# EAGLE design H4_MainController_Rev_1 (EAGLE 7.6.0)
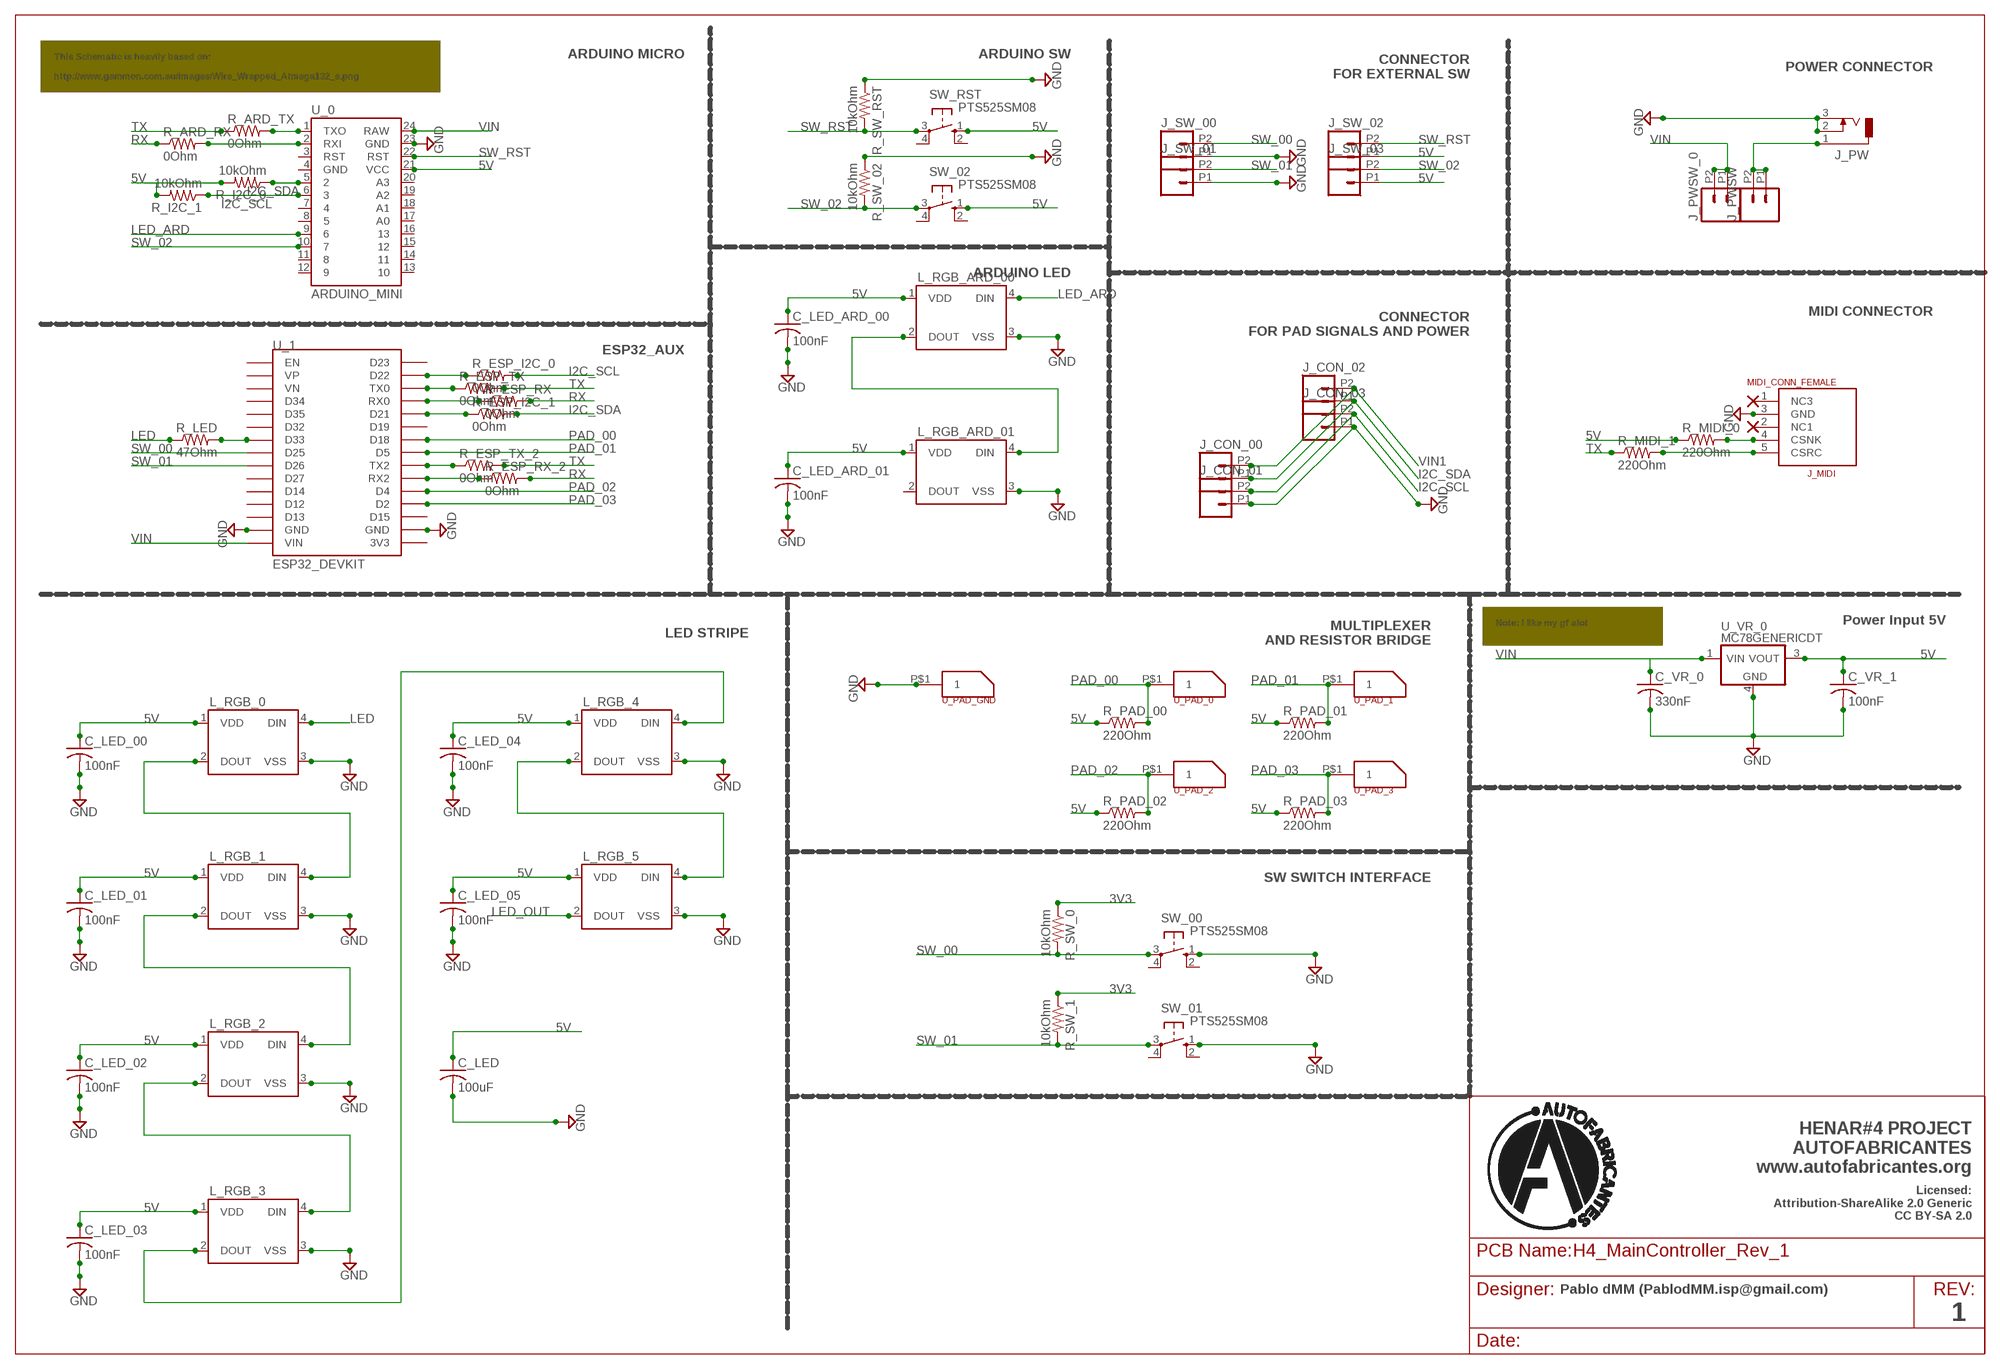
[diagram p0: schematic, sheet 1]

## Parts
C_LED  100uF  C-USC1210  [C1210]
C_LED_00  100nF  C-USC0805K  [C0805K]
C_LED_01  100nF  C-USC0805K  [C0805K]
C_LED_02  100nF  C-USC0805K  [C0805K]
C_LED_03  100nF  C-USC0805K  [C0805K]
C_LED_04  100nF  C-USC0805K  [C0805K]
C_LED_05  100nF  C-USC0805K  [C0805K]
C_LED_ARD_00  100nF  C-USC0805K  [C0805K]
C_LED_ARD_01  100nF  C-USC0805K  [C0805K]
C_VR_0  330nF  C-USC0805  [C0805]
C_VR_1  100nF  C-USC0805  [C0805]
J_CON_00  M022.54MM_SCREWTERM  [1X02_2.54_SCREWTERM]
J_CON_01  M022.54MM_SCREWTERM  [1X02_2.54_SCREWTERM]
J_CON_02  M022.54MM_SCREWTERM  [1X02_2.54_SCREWTERM]
J_CON_03  M022.54MM_SCREWTERM  [1X02_2.54_SCREWTERM]
J_MIDI  MIDI_CONN_FEMALE  [DIN_5_FEMALE]
J_PW  DCJ0303  [DCJ0303]
J_PWSW  M022.54MM_SCREWTERM  [1X02_2.54_SCREWTERM]
J_PWSW_0  M022.54MM_SCREWTERM  [1X02_2.54_SCREWTERM]
J_SW_00  M022.54MM_SCREWTERM  [1X02_2.54_SCREWTERM]
J_SW_01  M022.54MM_SCREWTERM  [1X02_2.54_SCREWTERM]
J_SW_02  M022.54MM_SCREWTERM  [1X02_2.54_SCREWTERM]
J_SW_03  M022.54MM_SCREWTERM  [1X02_2.54_SCREWTERM]
L_RGB_0  WS2812B  [WS2812B]
L_RGB_1  WS2812B  [WS2812B]
L_RGB_2  WS2812B  [WS2812B]
L_RGB_3  WS2812B  [WS2812B]
L_RGB_4  WS2812B  [WS2812B]
L_RGB_5  WS2812B  [WS2812B]
L_RGB_ARD_00  WS2812B  [WS2812B]
L_RGB_ARD_01  WS2812B  [WS2812B]
R_ARD_RX  0Ohm  R-US_M0805  [M0805]
R_ARD_TX  0Ohm  R-US_M0805  [M0805]
R_ESP_I2C_0  0Ohm  R-US_M0805  [M0805]
R_ESP_I2C_1  0Ohm  R-US_M0805  [M0805]
R_ESP_RX  0Ohm  R-US_M0805  [M0805]
R_ESP_RX_2  0Ohm  R-US_M0805  [M0805]
R_ESP_TX  0Ohm  R-US_M0805  [M0805]
R_ESP_TX_2  0Ohm  R-US_M0805  [M0805]
R_I2C_0  10kOhm  R-US_M0805  [M0805]
R_I2C_1  10kOhm  R-US_M0805  [M0805]
R_LED  47Ohm  R-US_M0805  [M0805]
R_MIDI_0  220Ohm  R-US_M0805  [M0805]
R_MIDI_1  220Ohm  R-US_M0805  [M0805]
R_PAD_00  220Ohm  R-US_M0805  [M0805]
R_PAD_01  220Ohm  R-US_M0805  [M0805]
R_PAD_02  220Ohm  R-US_M0805  [M0805]
R_PAD_03  220Ohm  R-US_M0805  [M0805]
R_SW_0  10kOhm  R-US_M0805  [M0805]
R_SW_1  10kOhm  R-US_M0805  [M0805]
R_SW_02  10kOhm  R-US_M0805  [M0805]
R_SW_RST  10kOhm  R-US_M0805  [M0805]
SW_00  PTS525SM08  [SM08]
SW_01  PTS525SM08  [SM08]
SW_02  PTS525SM08  [SM08]
SW_RST  PTS525SM08  [SM08]
U_0  ARDUINO_MINI  [ARDUINO_MINI]
U_1  ESP32_DEVKIT  [ESP32_DEVKIT]
U_PAD_0  PAD_CONNECTOR_MULTI  [PAD_CONNECTOR_MULTI]
U_PAD_1  PAD_CONNECTOR_MULTI  [PAD_CONNECTOR_MULTI]
U_PAD_2  PAD_CONNECTOR_MULTI  [PAD_CONNECTOR_MULTI]
U_PAD_3  PAD_CONNECTOR_MULTI  [PAD_CONNECTOR_MULTI]
U_PAD_GND  PAD_CONNECTOR_MULTI  [PAD_CONNECTOR_MULTI]
U_VR_0  MC78GENERICDT  [DPAK-3]

## Nets
3V3: R_SW_0.1 R_SW_1.1
5V [VCC]: C_LED.1 C_LED_00.1 C_LED_01.1 C_LED_02.1 C_LED_03.1 C_LED_04.1 C_LED_05.1 C_LED_ARD_00.1 C_LED_ARD_01.1 C_VR_1.1 J_SW_02.P1 J_SW_03.P1 L_RGB_0.1(VDD) L_RGB_1.1(VDD) L_RGB_2.1(VDD) L_RGB_3.1(VDD) L_RGB_4.1(VDD) L_RGB_5.1(VDD) L_RGB_ARD_00.1(VDD) L_RGB_ARD_01.1(VDD) R_I2C_0.2 R_I2C_1.2 R_MIDI_0.1 R_PAD_00.1 R_PAD_01.1 R_PAD_02.1 R_PAD_03.1 SW_02.1(S) SW_RST.1(S) U_0.21(VCC) U_VR_0.3(VOUT)
GND [GND]: C_LED.2 C_LED_00.2 C_LED_01.2 C_LED_02.2 C_LED_03.2 C_LED_04.2 C_LED_05.2 C_LED_ARD_00.2 C_LED_ARD_01.2 C_VR_0.2 C_VR_1.2 J_CON_01.P1 J_CON_03.P1 J_MIDI.3(GND) J_PW.2 J_PW.3 J_SW_00.P1 J_SW_01.P1 L_RGB_0.3(VSS) L_RGB_1.3(VSS) L_RGB_2.3(VSS) L_RGB_3.3(VSS) L_RGB_4.3(VSS) L_RGB_5.3(VSS) L_RGB_ARD_00.3(VSS) L_RGB_ARD_01.3(VSS) R_SW_02.1 R_SW_RST.1 SW_00.1(S) SW_01.1(S) U_0.23(GND) U_1.GND@1(GND) U_1.GND@2(GND) U_PAD_GND.P$1 U_VR_0.4(GND)
I2C_SCL: J_CON_01.P2 J_CON_03.P2 R_ESP_I2C_0.2 R_I2C_1.1 U_0.6
I2C_SDA: J_CON_00.P1 J_CON_02.P1 R_ESP_I2C_1.2 R_I2C_0.1 U_0.5
LED: L_RGB_0.4(DIN) R_LED.1
LED_ARD: L_RGB_ARD_00.4(DIN) U_0.9
LED_OUT: L_RGB_5.2(DOUT)
LEDE: L_RGB_3.2(DOUT) L_RGB_4.4(DIN)
N$1: R_ESP_TX.1 U_1.TX0
N$2: R_ESP_RX.1 U_1.RX0
N$3: L_RGB_2.2(DOUT) L_RGB_3.4(DIN)
N$4: J_MIDI.4(CSNK) R_MIDI_0.2
N$5: R_ARD_TX.2 U_0.1(TXO)
N$6: R_ARD_RX.2 U_0.2(RXI)
N$7: R_ESP_TX_2.1 U_1.TX2
N$8: R_LED.2 U_1.D33
N$9: L_RGB_1.2(DOUT) L_RGB_2.4(DIN)
N$10: L_RGB_0.2(DOUT) L_RGB_1.4(DIN)
N$11: R_ESP_RX_2.1 U_1.RX2
N$12: L_RGB_ARD_00.2(DOUT) L_RGB_ARD_01.4(DIN)
N$13: J_MIDI.5(CSRC) R_MIDI_1.2
N$14: L_RGB_4.2(DOUT) L_RGB_5.4(DIN)
N$15: R_ESP_I2C_0.1 U_1.D22
N$16: R_ESP_I2C_1.1 U_1.D21
N$17: J_PW.1 J_PWSW.P1 J_PWSW.P2
PAD_00: R_PAD_00.2 U_1.D18 U_PAD_0.P$1
PAD_01: R_PAD_01.2 U_1.D5 U_PAD_1.P$1
PAD_02: R_PAD_02.2 U_1.D4 U_PAD_2.P$1
PAD_03: R_PAD_03.2 U_1.D2 U_PAD_3.P$1
RX: R_ARD_RX.1 R_ESP_RX.2 R_ESP_RX_2.2
SW_00: J_SW_00.P2 R_SW_0.2 SW_00.3(P) U_1.D25
SW_01: J_SW_01.P2 R_SW_1.2 SW_01.3(P) U_1.D26
SW_02: J_SW_03.P2 R_SW_02.2 SW_02.3(P) U_0.10
SW_RST: J_SW_02.P2 R_SW_RST.2 SW_RST.3(P) U_0.22(RST)
TX: R_ARD_TX.1 R_ESP_TX.2 R_ESP_TX_2.2 R_MIDI_1.1
VIN [VCC]: C_VR_0.1 J_PWSW_0.P1 J_PWSW_0.P2 U_0.24(RAW) U_1.VIN U_VR_0.1(VIN)
VIN1: J_CON_00.P2 J_CON_02.P2
Unconnected: J_MIDI.1(NC3) J_MIDI.2(NC1) L_RGB_ARD_01.2(DOUT) SW_00.2(S) SW_00.4(P) SW_01.2(S) SW_01.4(P) SW_02.2(S) SW_02.4(P) SW_RST.2(S) SW_RST.4(P) U_0.3(RST) U_0.4(GND) U_0.7 U_0.8 U_0.11 U_0.12 U_0.13 U_0.14 U_0.15 U_0.16 U_0.17(A0) U_0.18(A1) U_0.19(A2) U_0.20(A3) U_1.3V3 U_1.D12 U_1.D13 U_1.D14 U_1.D15 U_1.D19 U_1.D23 U_1.D27 U_1.D32 U_1.D34 U_1.D35 U_1.EN U_1.VN U_1.VP

## Notes on the sheet
- This Schematic is heavily based on:
  
  http://www.gammon.com.au/images/Wire_Wrapped_Atmega132_e.png
- ARDUINO MICRO | ARDUINO SW
- CONNECTOR
  FOR EXTERNAL SW
- POWER CONNECTOR
- ARDUINO LED
- MIDI CONNECTOR
- CONNECTOR
  FOR PAD SIGNALS AND POWER
- ESP32_AUX
- Note: I like my gf alot | Power Input 5V
- LED STRIPE
- MULTIPLEXER
  AND RESISTOR BRIDGE
- SW SWITCH INTERFACE
- HENAR#4 PROJECT
  AUTOFABRICANTES
  www.autofabricantes.org
- Licensed:
  Attribution-ShareAlike 2.0 Generic
  CC BY-SA 2.0
- Pablo dMM (PablodMM.isp@gmail.com)
- 1

## Library data of the parts
C_LED C_LED_00 C_LED_01-C_LED_05 C_LED_ARD_00 C_LED_ARD_01 C_VR_0 C_VR_1 = adafruit:C-US: CAPACITOR, American symbol
J_CON_00 J_CON_01-J_CON_03 J_PWSW J_PWSW_0 J_SW_00 J_SW_01-J_SW_03 = SparkFun-Connectors:M02: Standard 2-pin 0.1" header. Use with - straight break away headers ( PRT-00116) - right angle break away headers (PRT-00553) - swiss pins (PRT-00743) - machine pins (PRT-00117) - female headers (PRT-00115) Molex polarized connector foot print use with: PRT-08233 with associated crimp pins and housings. 2.54_SCREWTERM for use with PRT-10571. 3.5mm Screw Terminal footprints for PRT-08084 5mm Screw Terminal footprints for use with PRT-08432
J_MIDI = SparkFun-Connectors:MIDI_CONN_FEMALE: MIDI connector, no strain relieve (DIN-5 female)
J_PW = con-jack:DCJ0303: DC POWER JACK Source: DCJ0303.pdf; OC_FARNELL: unknown; OC_NEWARK: unknown
L_RGB_0 L_RGB_1-L_RGB_5 L_RGB_ARD_00 L_RGB_ARD_01 = SparkFun-LED:WS2812B: WS2812B - Intelligent control LED integrated light source Technical Specifications: Power Supply Voltage (VDD): 3.5 to 5.3 V Input Voltage (VI): -0.5 to VDD+0.5 V Operating Junction Temperature (Topt): -25°C to +80°C Storage Temperature Range (Tstg): -55°C to +150°C; PROD_ID: DIO-12503
R_ARD_RX R_ARD_TX R_ESP_I2C_0 R_ESP_I2C_1 R_ESP_RX R_ESP_RX_2 R_ESP_TX R_ESP_TX_2 R_I2C_0 R_I2C_1 R_LED R_MIDI_0 R_MIDI_1 R_PAD_00 R_PAD_01-R_PAD_03 R_SW_0 R_SW_1 R_SW_02 R_SW_RST = adafruit:R-US_: RESISTOR, American symbol
SW_00 SW_01 SW_02 SW_RST = pts525_20:PTS525*: PTS 525 Series Miniature Tact Switch for SMD Source: http://www.ck-components.com/14407/pts525_8sept14.pdf/; MF: C&K Components; MPN: PTS525SM08SMTR2LFS; OC_FARNELL: unknown; OC_NEWARK: unknown
U_0 = SparkFun-Boards:ARDUINO_MINI: Arduino Pro Mini footprint
U_1 = DOIT_ESP32_DEVKIT:ESP32_DEVKIT: ESP32 DEVKIT BOARD
U_PAD_0 U_PAD_1-U_PAD_3 U_PAD_GND = atfHenar_customLib:PAD_CONNECTOR_MULTI
U_VR_0 = _hhn_78xx_79xx_NCV78xx_d2pak_dpak:MC78*: 78xx SMD (D2PAK, DPAK) (MC)78xx..DT (DPAK-3; Rth,JA = 92 K/W) (MC)78xx..D2T (D2PAK-3; Rth,JA = 45 K/W @ 10x10mm copper area) Linear Voltage Regulators, Positive, 1 A (ON Semiconductor) Package dimenisions and soldering footprints acc. to ONSEMI specs. Source: http://onsemi.com Datasheet document#: MC7800/D Technologies: 78xxyD(2)Tz: xx = Output Voltage (V) y, z: additional suffixes see manufacturer's datasheet Author: Dipl.-Ing. FH Rainer Bayer HHN Hochschule Heilbronn, rainer.bayer@hs-heilbronn.de Ingenieurbüro ing-rb, mail@ing-rb.de

## Net classes
1 GND: width 0.508 mm, clearance 0.305 mm
2 VCC: width 0.508 mm, clearance 0.305 mm to class 1

## Board
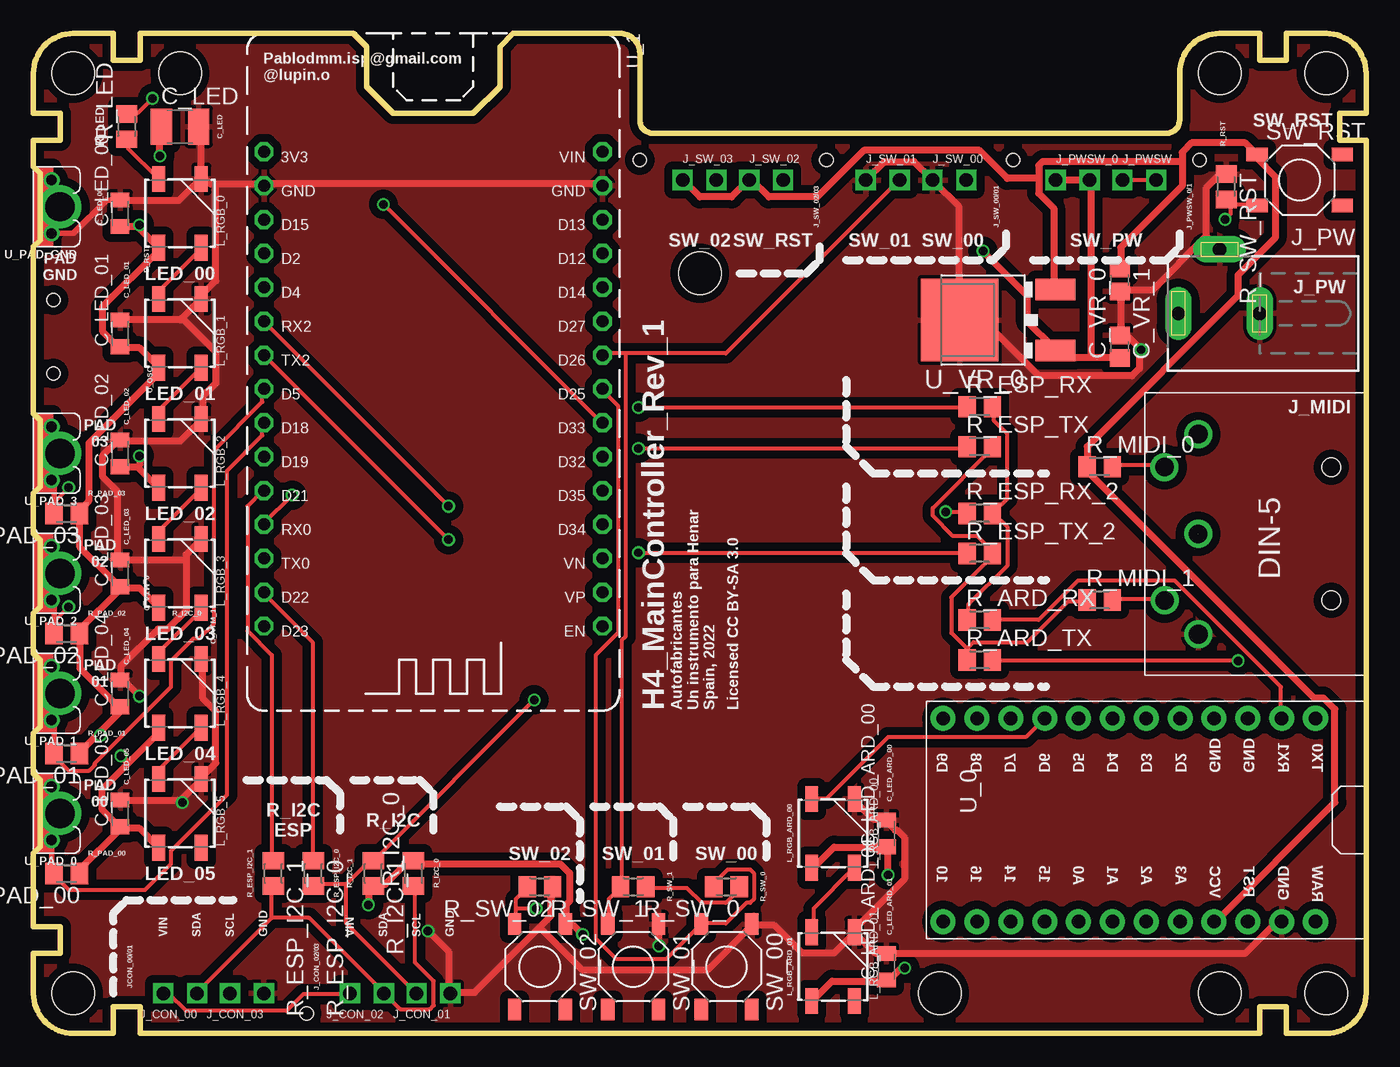
[diagram p1: board, top side]
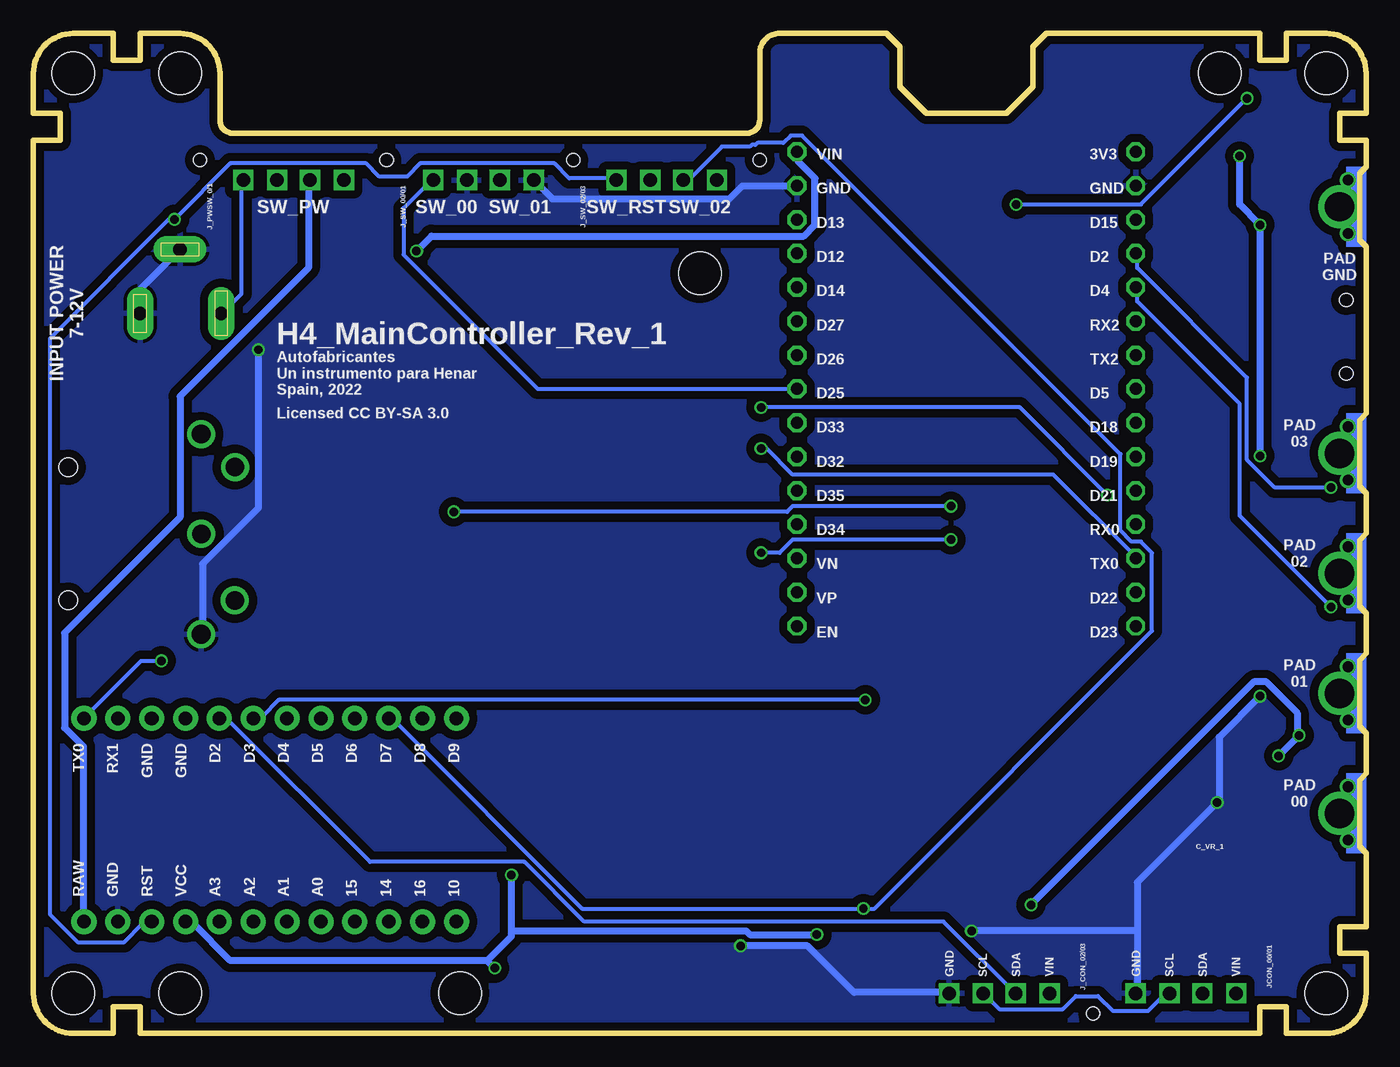
[diagram p2: board, bottom side, seen from below]

Size 100 x 75 mm. Coordinates in mm from the lower left corner, seen from the top.
Outline: 97,0 94,0 94,2 92,2 92,0 8,0 8,2 6,2 6,0 3,0 arc-90 0,3 0,6 2,6 2,8 0,8 0,13.5 0.5,14 0.5,19 0,19.5 0,22.5 0.5,23 0.5,28 0,28.5 0,31.5 0.5,32 0.5,37 0,37.5 0,40.5 0.5,41 0.5,46 0,46.5 0,59 0.5,59.5 0.5,64.5 0,65 0,67 2,67 2,69 0,69 0,72 arc-90 3,75 6,75 6,73 8,73 8,75 24,75 25,74 25,71 27,69 33,69 35,71 35,74 36,75 44,75 arc-90 45.5,73.5 45.5,68.5 arc90 46.5,67.5 85,67.5 arc90 86,68.5 86,72 arc-90 89,75 92,75 92,73 94,73 94,75 97,75 arc-90 100,72 100,69 98,69 98,67 100,67 100,3 arc-90 97,0
Copper layers (1*16): Top 0.035mm / dielectric 1.5mm / Bottom 0.035mm
Design rules "default *": minimum track width 12mil, minimum drill 25mil, track to track 10mil, track to pad 10mil, pad to pad 10mil, via to via 10mil, smd to smd 8mil, copper to edge 20mil, drill to drill 8mil, minimum pad ring 5mil, minimum via ring 5mil, stop-mask expansion 4mil, vias tented up to drill 0mil, thermal gap 10mil
Holes 1 mm at 20.5,1.5 20.5,1.5 1.5,55 1.5,49.5 87.5,65.5 73.5,65.5 59.5,65.5 45.5,65.5 73.5,65.5 59.5,65.5
Holes 3.2 mm at 97,3 3,3 3,72 97,72 68,3 89,3 89,72 11,72 50,57

### Footprints (pad centres in the part's own frame; a part is rotated, then mirrored left to right if it is on the bottom)
C1210 = smd 1.6 x 2.7: 1 -1.4,0; 2 1.4,0
C0805K = smd 1.1 x 1.4: 1 -1,0; 2 1,0
C0805 = smd 1.3 x 1.5: 1 -0.85,0; 2 0.85,0
1X02_2.54_SCREWTERM = drill 1.016 square: P1 2.54,0; P2 0,0
DIN_5_FEMALE = drill 1.4: 1 7.94,3.6; 2 0.46,3.61; 3 -7.07,3.6; 4 5.47,6.13; 5 -4.53,6.12 | hole 1.4: -4.52,-6.38; 5.47,-6.38
DCJ0303 = drill 1 pad 2 long: 1 0,3.1; 2 4.8,0; 3 0,-3
WS2812B = smd 1.93 x 0.965: 1 -2.577,1.6; 2 -2.577,-1.6; 3 2.577,-1.6; 4 2.577,1.6
M0805 = smd 1.3 x 1.6: 1 -0.95,0; 2 0.95,0
SM08 = smd 1.6 x 1: 1 -3.2,1.9; 2 3.2,1.9; 3 -3.2,-1.9; 4 3.2,-1.9
ARDUINO_MINI = drill 1.016 pad 1.88: 1 -7.62,12.7; 2 -7.62,10.16; 3 -7.62,7.62; 4 -7.62,5.08; 5 -7.62,2.54; 6 -7.62,0; 7 -7.62,-2.54; 8 -7.62,-5.08; 9 -7.62,-7.62; 10 -7.62,-10.16; 11 -7.62,-12.7; 12 -7.62,-15.24; 13 7.62,-15.24; 14 7.62,-12.7; 15 7.62,-10.16; 16 7.62,-7.62; 17 7.62,-5.08; 18 7.62,-2.54; 19 7.62,0; 20 7.62,2.54; 21 7.62,5.08; 22 7.62,7.62; 23 7.62,10.16; 24 7.62,12.7
ESP32_DEVKIT = drill 0.9 pad 1.422 octagon: 3V3 12.7,8.89; D2 12.7,16.51; D4 12.7,19.05; D5 12.7,26.67; D12 -12.7,16.51; D13 -12.7,13.97; D14 -12.7,19.05; D15 12.7,13.97; D18 12.7,29.21; D19 12.7,31.75; D21 12.7,34.29; D22 12.7,41.91; D23 12.7,44.45; D25 -12.7,26.67; D26 -12.7,24.13; D27 -12.7,21.59; D32 -12.7,31.75; D33 -12.7,29.21; D34 -12.7,36.83; D35 -12.7,34.29; EN -12.7,44.45; GND@1 -12.7,11.43; GND@2 12.7,11.43; RX0 12.7,36.83; RX2 12.7,21.59; TX0 12.7,39.37; TX2 12.7,24.13; VIN -12.7,8.89; VN -12.7,39.37; VP -12.7,41.91
PAD_CONNECTOR_MULTI = drill 0.8: P$1 0.63,2; P$2 0.63,-2 | drill 2.2: P$3 0,0
DPAK-3 = smd 1.6 x 3: 1 -2.286,-7.18; 3 2.286,-7.18 | smd 6.2 x 5.8: 4 0,0

### Placement (x,y rotation side)
C_LED  11,68 0 top
C_LED_00  6.5,61.5 90 top
C_LED_01  6.5,52.5 90 top
C_LED_02  6.5,43.5 90 top
C_LED_03  6.5,34.5 90 top
C_LED_04  6.5,25.5 90 top
C_LED_05  6.5,16.5 90 top
C_LED_ARD_00  64,15 90 top
C_LED_ARD_01  64,5 90 top
C_VR_0  81.5,51.5 90 top
C_VR_1  81.5,56.5 270 top
J_CON_00  9.75,3 0 top
J_CON_01  28.75,3 0 top
J_CON_02  23.75,3 0 top
J_CON_03  14.75,3 0 top
J_MIDI  91,37 90 top
J_PW  89,54 90 top
J_PWSW  84.25,64 180 top
J_PWSW_0  79.25,64 180 top
J_SW_00  70,64 180 top
J_SW_01  65,64 180 top
J_SW_02  56.25,64 180 top
J_SW_03  51.25,64 180 top
L_RGB_0  11,61.5 90 top
L_RGB_1  11,52.5 90 top
L_RGB_2  11,43.5 90 top
L_RGB_3  11,34.5 90 top
L_RGB_4  11,25.5 90 top
L_RGB_5  11,16.5 90 top
L_RGB_ARD_00  60,15 90 top
L_RGB_ARD_01  60,5 90 top
R_ARD_RX  71,31 0 top
R_ARD_TX  71,28 0 top
R_ESP_I2C_0  21,12 270 top
R_ESP_I2C_1  18,12 270 top
R_ESP_RX  71,47 0 top
R_ESP_RX_2  71,39 0 top
R_ESP_TX  71,44 0 top
R_ESP_TX_2  71,36 0 top
R_I2C_0  28.5,12 90 top
R_I2C_1  25.5,12 270 top
R_LED  7,68 90 top
R_MIDI_0  80,42.5 0 top
R_MIDI_1  80,32.5 0 top
R_PAD_00  2.5,12 180 top
R_PAD_01  2.5,21 180 top
R_PAD_02  2.5,30 180 top
R_PAD_03  2.5,39 180 top
R_SW_0  52,11 180 top
R_SW_1  45,11 180 top
R_SW_02  38,11 180 top
R_SW_RST  89.5,63.5 270 top
SW_00  52,5 270 top
SW_01  45,5 270 top
SW_02  38,5 270 top
SW_RST  95,64 0 top
U_0  83.5,16 270 top
U_1  30,75 180 top
U_PAD_0  2,16.5 180 top
U_PAD_1  2,25.5 180 top
U_PAD_2  2,34.5 180 top
U_PAD_3  2,43.5 180 top
U_PAD_GND  2,62 180 top
U_VR_0  69.5,53.5 90 top

### Tracks (layer width: path | path; a pad name or v marks a point on that pad's centre or on a via)
3V3
  Top 0.305: R_SW_1.1 45.96,10.9 49.03,10.9 50.15,9.78 51.97,9.78 53.09,10.9 R_SW_0.1
5V  (via drill 0.64)
  Top 0.508: J_SW_03.P1 48.76,63.98 50.01,62.73 52.39,62.73 53.65,63.98 J_SW_02.P1 53.92,63.98 55.18,62.73 58.81,62.73 62.31,66.22 70.97,66.22 73.06,64.12 75.44,64.12 | 86.19,65.38 86.19,66.08 86.89,66.78 90.94,66.78 91.78,65.94 SW_RST.1 91.78,65.66 93.18,64.26 93.18,59.65 90.39,56.86 90.39,55.32 79.07,44.01 79.07,42.61 R_MIDI_0.1 79.21,42.33 79.21,42.05 96.11,25.15 96.81,25.15 97.65,24.31 97.65,17.32 88.71,8.38 U_0.21 | 86.19,65.38 86.19,63.56 81.58,58.95 81.58,57.42 C_VR_1.1 | 75.44,64.12 75.44,65.1 75.72,65.38 86.19,65.38 | 75.44,64.12 75.44,63.01 76.56,61.89 76.56,55.88 U_VR_0.3 | 7.82,42.47 6.57,42.47 C_LED_02.1 | 7.82,42.47 9.36,40.93 L_RGB_2.1 | 7.82,60.49 6.57,60.49 C_LED_00.1 | 7.82,60.49 9.36,58.95 L_RGB_0.1 9.36,58.67 5.17,54.48 5.17,52.67 6.29,51.55 C_LED_01.1 6.57,51.41 7.96,51.41 9.36,50.01 L_RGB_1.1 9.22,49.73 9.22,49.31 4.19,44.28 4.19,39.95 3.49,39.26 R_PAD_03.1 3.49,38.98 3.49,36.46 6.29,33.67 C_LED_03.1 | v9.5,65.8 9.5,67.89 C_LED.1 | v7.96,60.63 7.82,60.49 | v7.96,43.31 7.96,42.61 7.82,42.47 | C_LED_05.1 6.57,15.37 7.96,15.37 9.36,13.97 L_RGB_5.1 | R_PAD_00.1 3.49,12.01 3.49,12.29 6.43,15.23 C_LED_05.1 | 7.12,20.26 5.17,18.3 5.17,16.76 6.29,15.65 C_LED_05.1 | 7.12,20.26 9.36,22.49 9.36,22.91 L_RGB_4.1 | 4.89,22.49 3.49,21.09 R_PAD_01.1 | 4.89,22.49 6.43,24.03 6.43,24.45 C_LED_04.1 6.29,24.59 3.49,27.38 3.49,29.76 R_PAD_02.1 3.49,30.04 3.49,30.32 6.43,33.25 C_LED_03.1 | C_LED_03.1 6.57,33.39 7.96,33.39 9.36,31.99 L_RGB_3.1 | v6.57,20.82 7.12,20.26 | v5.03,22.35 4.89,22.49 | L_RGB_ARD_00.1 58.53,12.43 60.07,13.97 63.98,13.97 C_LED_ARD_00.1 64.12,13.83 v64.12,11.87
  Top 0.508: L_RGB_ARD_01.1 58.53,2.52 59.93,3.91 63.98,3.91 C_LED_ARD_01.1 64.26,4.05 65.1,4.89 v65.38,4.89 | v41.21,7.4 40.51,8.1 40.09,8.1 SW_02.1 39.95,8.24 39.95,9.64 40.23,9.92 40.23,12.01 39.53,12.71 28.64,12.71 R_I2C_0.2 28.5,12.85 28.08,12.85 26.4,11.18 25.57,11.18 R_I2C_1.2 25.29,10.9 25.15,10.76 v25.15,9.64
  Bottom 0.508: v9.5,65.8 9.5,62.17 v7.96,60.63 v7.96,43.31 | v6.57,20.82 v5.03,22.35 5.17,22.49 5.17,24.03 7.54,26.4 8.38,26.4 v25.15,9.64 | 65.94,5.45 85.22,5.45 88.01,8.24 88.57,8.24 U_0.21 | v65.38,4.89 65.94,5.45 | 64.12,7.68 64.12,7.26 65.94,5.45 | 64.12,7.68 v64.12,11.87 | v41.21,7.4 46.24,7.4 46.52,7.68 64.12,7.68
GND  (via drill 0.64)
  Top 0.406: U_PAD_GND.P$1 3,60 5.5,62.5 C_LED_00.2
  Top 0.508: v46.94,6.57 46.94,8.1 SW_01.1 | 38,7.96 33.11,3.07 31.29,3.07 J_CON_01.P1 31.15,3.21 31.15,6.15 v29.62,7.68 | 38,7.96 38.84,8.8 38.84,10.9 R_SW_02.1 | L_RGB_ARD_00.3 61.61,17.46 63.01,16.07 63.98,16.07 C_LED_ARD_00.2 64.12,15.79 64.68,15.23 64.82,15.23 65.38,14.67 65.38,11.6 61.61,7.82 L_RGB_ARD_01.3 | L_RGB_ARD_01.3 61.61,7.54 63.14,6.01 63.98,6.01 C_LED_ARD_01.2 64.26,6.01 90.94,6.01 93.18,8.24 93.6,8.24 U_0.23 | L_RGB_ARD_01.3 61.47,7.4 60.07,6.01 57.7,6.01 55.6,8.1 53.92,8.1 SW_00.1 53.78,7.96 50.57,4.75 41.21,4.75 38,7.96 | 11.04,17.46 6.57,17.46 C_LED_05.2 | 11.04,17.46 12.57,19 L_RGB_5.3 12.71,19.28 13.69,20.26 13.69,24.17 12.71,25.15 12.71,27.94 L_RGB_4.3 | v11.18,17.32 11.04,17.46 | L_RGB_0.3 12.57,64.12 12.57,67.75 12.43,67.89 C_LED.2 | 13.69,63.7 13.27,63.7 12.85,64.12 L_RGB_0.3 | 13.69,63.7 17.18,63.7 U_1.GND@2 17.46,63.7 42.61,63.7 U_1.GND@1 | C_LED_00.2 6.57,62.45 10.9,62.45 12.43,63.98 L_RGB_0.3 | 11.46,35.48 11.46,35.9 12.57,37.02 L_RGB_3.3 | 11.46,35.48 11.46,31.71 10.06,30.32 9.36,30.32 6.57,27.52 6.57,26.54 C_LED_04.2 6.71,26.54 v7.96,25.29 | 11.46,35.48 6.57,35.48 C_LED_03.2 6.29,35.62 6.29,40.65 5.17,41.77 5.17,43.31 6.29,44.42 C_LED_02.2 6.57,44.42 11.04,44.42 12.57,45.96 L_RGB_2.3 12.71,46.24 12.71,47.78 13.69,48.76 13.69,51.13 11.18,53.65 | 11.18,53.65 12.57,55.04 L_RGB_1.3 12.57,55.32 13.69,56.44 13.69,63.7 | 11.18,53.65 11.04,53.51 6.57,53.51 C_LED_01.2 | J_SW_01.P1 62.59,64.12 63.84,65.38 66.08,65.38 67.33,64.12 J_SW_00.P1 67.61,63.84 69.43,62.03 69.43,53.51 U_VR_0.4 69.71,53.37 71.39,53.37 75.44,49.31 82.42,49.31 82.98,49.87 82.98,51.13 v83.12,51.27 82.14,52.25 81.72,52.25 C_VR_0.2 81.58,52.39 81.58,55.6 C_VR_1.2 81.72,55.74 83.96,55.74 87.87,59.65 J_PW.2 88.99,58.81 88.01,59.79 88.01,63.42 88.99,64.4 89.41,64.4 R_SW_RST.1
  Bottom 0.508: v46.94,6.57 41.91,6.57 38.42,3.07 31.29,3.07 J_CON_01.P1 | 17.18,7.68 17.18,11.32 v11.18,17.32 11.04,17.46 11.04,22.21 v7.96,25.29 | 17.18,7.68 17.18,3.07 J_CON_03.P1 | U_1.GND@1 42.75,63.56 46.8,63.56 47.78,62.59 61.05,62.59 62.45,63.98 J_SW_01.P1 | J_PW.3 91.92,54.06 91.92,55.88 89.13,58.67 J_PW.2 | v83.12,51.27 83.12,39.4 87.31,35.2 87.31,30.04 J_MIDI.3 | 17.18,7.68 v29.62,7.68
  pour Top (isolate 0.61): 92,75 89,75 arc90 86,72 86,68.5 arc-90 85,67.5 46.5,67.5 arc-90 45.5,68.5 45.5,73.5 arc90 44,75 36,75 35,74 35,71 33,69 27,69 25,71 25,74 24,75 8,75 8,73 6,73 6,75 3,75 arc90 0,72 0,69 2,69 2,67 0,67 0,65 0.5,64.5 0.5,59.5 0,59 0,46.5 0.5,46 0.5,41 0,40.5 0,37.5 0.5,37 0.5,32 0,31.5 0,28.5 0.5,28 0.5,23 0,22.5 0,19.5 0.5,19 0.5,14 0,13.5 0,8 2,8 2,6 0,6 0,3 arc90 3,0 6,0 6,2 8,2 8,0 92,0 92,2 94,2 94,0 97,0 arc90 100,3 100,67 98,67 98,69 100,69 100,72 arc90 97,75 94,75 94,73 92,73
  pour Bottom (isolate 0.61): 94,73 92,73 92,75 89,75 arc90 86,72 86,68.5 arc-90 85,67.5 46.5,67.5 arc-90 45.5,68.5 45.5,73.5 arc90 44,75 36,75 35,74 35,71 33,69 27,69 25,71 25,74 24,75 8,75 8,73 6,73 6,75 3,75 arc90 0,72 0,69 2,69 2,67 0,67 0,65 arc-90 0.5,64.5 0.5,59.5 0,59 0,46.5 0.5,46 0.5,41 0,40.5 0,37.5 0.5,37 0.5,32 0,31.5 0,28.5 0.5,28 0.5,23 0,22.5 0,19.5 0.5,19 0.5,14 0,13.5 0,8 2,8 2,6 0,6 0,3 arc90 3,0 6,0 6,2 8,2 8,0 92,0 92,2 94,2 94,0 97,0 arc90 100,3 100,67 98,67 98,69 100,69 100,72 arc90 97,75 94,75
I2C_SCL  (via drill 0.64)
  Top 0.305: 23.47,11.18 21.09,11.18 R_ESP_I2C_0.2 | 23.47,11.18 25.15,12.85 25.43,12.85 R_I2C_1.1 25.57,12.99 v37.58,25.01 | 23.47,11.18 23.47,8.24 28.64,3.07 J_CON_01.P2
  Bottom 0.305: J_CON_03.P2 14.81,2.93 15.09,2.93 16.34,1.68 19,1.68 20.12,2.79 21.79,2.79 22.77,1.82 27.52,1.82 28.64,2.93 J_CON_01.P2 | v37.58,25.01 81.58,25.01 82.84,23.75 83.4,23.75 U_0.6
I2C_SDA
  Top 0.305: 17.88,8.66 17.88,11.04 R_ESP_I2C_1.2 | 17.88,8.66 12.29,3.07 J_CON_00.P1 | R_I2C_0.1 28.64,11.04 28.64,5.31 30.04,3.91 30.04,2.1 29.76,1.82 27.52,1.82 26.4,2.93 J_CON_02.P1 26.26,3.07 20.68,8.66 17.88,8.66
  Bottom 0.305: U_0.5 85.92,23.61 85.5,23.61 74.74,12.85 63.14,12.85 58.67,8.38 31.71,8.38 26.4,3.07 J_CON_02.P1
LED
  Top 0.305: R_LED.1 7.12,66.92 7.12,66.36 9.36,64.12 L_RGB_0.4
LED_ARD
  Top 0.305: L_RGB_ARD_00.4 58.53,17.6 59.51,17.6 64.12,22.21 74.46,22.21 75.86,23.61 U_0.9
LEDE
  Top 0.305: L_RGB_4.4 9.5,28.08 9.5,28.64 12.71,31.85 L_RGB_3.2
N$1  (via drill 0.64)
  Top 0.305: v45.4,43.87 69.99,43.87 R_ESP_TX.1
  Bottom 0.305: v45.4,43.87 44.98,43.87 43.03,41.91 23.47,41.91 17.32,35.76 U_1.TX0
N$2  (via drill 0.64)
  Top 0.305: v45.4,46.94 69.99,46.94 R_ESP_RX.1 | v19.42,40.37 17.32,38.28 U_1.RX0
  Bottom 0.305: v45.4,46.94 25.98,46.94 v19.42,40.37
N$3
  Top 0.305: L_RGB_3.4 9.5,37.16 9.5,37.72 12.57,40.79 L_RGB_2.2
N$4
  Top 0.305: R_MIDI_0.2 81.03,42.61 84.8,42.61 J_MIDI.4
N$5  (via drill 0.64)
  Top 0.305: v90.39,27.94 72.08,27.94 R_ARD_TX.2
  Bottom 0.305: v90.39,27.94 91.92,27.94 96.11,23.75 U_0.1
N$6
  Top 0.305: R_ARD_RX.2 72.08,31.01 75.44,31.01 78.37,33.95 85.64,33.95 93.6,25.98 93.6,23.75 U_0.2
N$7  (via drill 0.64)
  Top 0.305: v45.4,36.04 69.99,36.04 R_ESP_TX_2.1 | v31.15,37.02 17.32,50.85 U_1.TX2
  Bottom 0.305: v45.4,36.04 44.01,36.04 43.03,37.02 v31.15,37.02
N$8  (via drill 0.64)
  Top 0.305: v8.94,70.13 7.82,69.01 7.12,69.01 R_LED.2 | v26.26,62.17 42.61,45.82 U_1.D33
  Bottom 0.305: v8.94,70.13 16.9,62.17 v26.26,62.17
N$9
  Top 0.305: L_RGB_2.4 9.5,46.1 9.5,46.8 12.57,49.87 L_RGB_1.2
N$10
  Top 0.305: L_RGB_1.4 9.5,55.18 9.5,55.74 12.57,58.81 L_RGB_0.2
N$11  (via drill 0.64)
  Top 0.305: v68.45,39.12 69.99,39.12 R_ESP_RX_2.1 | v31.15,39.53 17.32,53.37 U_1.RX2
  Bottom 0.305: v68.45,39.12 43.45,39.12 43.03,39.53 v31.15,39.53
N$12
  Top 0.305: L_RGB_ARD_01.4 58.53,7.68 58.53,9.36 61.47,12.29 L_RGB_ARD_00.2
N$13
  Top 0.305: R_MIDI_1.2 81.03,32.55 84.8,32.55 J_MIDI.5
N$14
  Top 0.305: L_RGB_5.4 9.5,19.14 9.5,19.84 12.57,22.91 L_RGB_4.2
N$15
  Top 0.305: R_ESP_I2C_0.1 20.95,12.99 20.95,29.34 17.32,32.97 U_1.D22
N$16
  Top 0.305: R_ESP_I2C_1.1 17.88,12.99 17.88,28.36 16.07,30.18 16.07,39.53 17.18,40.65 U_1.D21
N$17
  Top 0.305: J_PWSW.P1 81.72,63.98 84.24,63.98 J_PWSW.P2
  Bottom 0.305: J_PWSW.P2 84.38,63.98 84.38,55.46 85.78,54.06 J_PW.1
N$18
  pour Top (isolate 0.61): 94,73 92,73 92,75 89,75 arc90 86,72 86,68.5 arc-90 85,67.5 46.5,67.5 arc-90 45.5,68.5 45.5,73.5 arc90 44,75 36,75 35,74 35,71 33,69 27,69 25,71 25,74 24,75 8,75 8,73 6,73 6,75 3,75 arc90 0,72 0,69 2,69 2,67 0,67 0,65 0.5,64.5 0.5,59.5 0,59 0,46.5 0.5,46 0.5,41 0,40.5 0,37.5 0.5,37 0.5,32 0,31.5 0,28 0.5,27.5 0.5,23 0,22.5 0,19.5 0.5,19 0.5,14 0,13.5 0,8 2,8 2,6 0,6 0,3 arc90 3,0 6,0 6,2 8,2 8,0 92,0 92,2 94,2 94,0 97,0 arc90 100,3 100,67 98,67 98,69 100,69 100,72 arc90 97,75 94,75
N$19
  pour Bottom (isolate 0.61): 6,75 3,75 arc90 0,72 0,69 2,69 2,67 0,67 0,65 0.5,64.5 0.5,59.5 0,59 0,46.5 0.5,46 0.5,41 0,40.5 0,37.5 0.5,37 0.5,32 0,31.5 0,28.5 0.5,28 0.5,23 0,22.5 0,19.5 0.5,19 0.5,14 0,13.5 0,8 1.5,8 2,8 2,6 0,6 0,3 arc90 3,0 6,0 6,2 8,2 8,0 92,0 92,2 94,2 94,0 97,0 arc90 100,3 100,67 98,67 98,69 100,69 100,72 arc90 97,75 94,75 94,73 92,73 92,75 89,75 arc90 86,72 86,68.5 arc-90 85,67.5 46.5,67.5 arc-90 45.5,68.5 45.5,73.5 arc90 44,75 36,75 35,74 35,71 33,69 27,69 25,71 25,74 24,75 8,75 8,73 6,73
PAD_00
  Top 0.305: U_1.D18 17.18,45.68 17.18,44.84 14.53,42.19 14.53,17.88 10.34,13.69 10.34,12.71 8.38,10.76 2.65,10.76 1.54,11.87 R_PAD_00.2
  Top 0.406: R_PAD_00.2 1.37,12.18 U_PAD_0.P$1
PAD_01
  Top 0.305: U_1.D5 17.18,48.2 17.18,47.36 13.55,43.73 13.55,30.73 12.43,29.62 12.01,29.62 10.34,27.94 10.34,25.98 4.61,20.26 4.61,20.12 4.19,19.7 2.65,19.7 1.54,20.82 R_PAD_01.2
  Top 0.406: U_PAD_1.P$1 1.55,23.32 R_PAD_01.2
PAD_02  (via drill 0.64)
  Top 0.305: v2.65,31.99 1.68,31.01 1.55,31.01
  Top 0.406: U_PAD_2.P$1 1.55,32.32 1.55,31.01 R_PAD_02.2
  Bottom 0.305: v2.65,31.99 9.5,38.84 9.5,47.22 17.18,54.9 17.18,55.88 U_1.D4
PAD_03  (via drill 0.64)
  Top 0.305: v2.65,40.93 1.68,39.95 1.55,39.95
  Top 0.406: U_PAD_3.P$1 1.55,41.32 1.55,39.95 R_PAD_03.2
  Bottom 0.305: v2.65,40.93 6.84,40.93 8.94,43.03 8.94,49.17 17.18,57.42 17.18,58.4 U_1.D2
RX
  Top 0.305: R_ARD_RX.1 70.13,31.01 70.13,32.13 73.06,35.06 73.06,38 72.08,38.98 R_ESP_RX_2.2 72.08,39.12 73.06,40.09 73.06,44.98 72.08,45.96 72.08,46.94 R_ESP_RX.2
SW_00
  Top 0.305: R_SW_0.2 51.13,11.04 51.13,11.32 52.11,12.29 53.78,12.29 54.06,12.01 54.06,10.06 53.78,9.78 53.51,9.78 51.97,8.24 50.15,8.24 SW_00.3 50.01,8.1 47.5,5.59 43.73,5.59 42.19,7.12 42.19,28.36 43.87,30.04 43.87,47.08 42.75,48.2 U_1.D25
  Bottom 0.305: U_1.D25 42.75,48.34 62.17,48.34 72.22,58.4 72.22,61.89 70.13,63.98 J_SW_00.P2
SW_01
  Top 0.305: SW_01.3 43.17,8.24 43.17,10.06 44.01,10.9 R_SW_1.2 44.15,11.04 44.15,29.48 44.42,29.76 44.42,50.99 | 44.42,50.99 51.97,50.99 64.96,63.98 J_SW_01.P2 | 44.42,50.99 42.75,50.99 U_1.D26
SW_02  (via drill 0.64)
  Top 0.305: 36.18,9.36 36.18,10.06 37.02,10.9 R_SW_02.2 | 36.18,9.36 36.18,8.24 SW_02.3 | v37.72,9.36 36.18,9.36
  Bottom 0.305: U_0.10 73.2,23.75 58.81,9.36 v37.72,9.36 36.88,9.36 16.07,30.18 16.07,36.04 16.9,36.88 17.6,36.88 18.44,37.72 18.44,43.45 42.33,67.33 43.17,67.33 43.73,66.78 45.68,66.78 45.82,66.64 46.1,66.64 46.24,66.5 48.34,66.5 50.71,64.12 51.13,64.12 J_SW_03.P2
SW_RST  (via drill 0.64)
  Top 0.305: SW_RST.3 91.78,62.17 89.83,62.17 89.55,62.45 R_SW_RST.2 89.83,62.03 89.83,61.47 v89.41,61.05
  Bottom 0.305: J_SW_02.P2 56.3,64.12 59.79,64.12 60.91,65.24 70.97,65.24 71.94,64.26 74.04,64.26 75.02,65.24 85.22,65.24 v89.41,61.05 89.83,61.05 98.77,52.11 98.77,8.94 96.67,6.84 93.18,6.84 91.78,8.24 91.22,8.24 U_0.22
TX
  Top 0.305: 69.99,28.92 69.99,28.08 R_ARD_TX.1 | 69.99,28.92 68.87,30.04 68.87,32.69 72.08,35.9 R_ESP_TX_2.2 72.08,36.04 70.83,37.3 69.01,37.3 67.47,38.84 67.47,39.4 71.94,43.87 R_ESP_TX.2 | R_MIDI_1.1 78.93,32.41 77.67,32.41 74.6,29.34 70.55,29.34 70.13,28.92 69.99,28.92
VIN  (via drill 0.64)
  Top 0.508: 79.35,50.71 77.11,50.71 76.69,51.13 U_VR_0.1 76.56,51.41 74.6,53.37 74.6,55.32 v71.25,58.67 | 79.35,50.71 81.44,50.71 C_VR_0.1 | J_PWSW_0.P1 76.83,63.98 79.21,63.98 J_PWSW_0.P2 79.35,63.84 79.35,50.71
  Bottom 0.508: v71.25,58.67 70.13,59.79 42.19,59.79 41.35,60.63 41.35,64.12 42.61,65.38 42.61,66.08 U_1.VIN | U_0.24 96.25,8.38 96.25,21.51 97.65,22.91 97.65,30.04 88.99,38.7 88.99,47.78 79.35,57.42 79.35,63.98 J_PWSW_0.P2
VIN1
  Top 0.305: J_CON_00.P2 9.78,2.93 10.2,2.93 11.46,1.68 19,1.68 20.26,2.93 23.75,2.93 J_CON_02.P2

### Text on the board
t_Silk: Pablodmm.isp@gmail.com / @lupin.o | R_LED | C_LED | R_RST | SW_RST | C_LED_00 | J_SW_02/03 | J_SW_00/01 | J_PWSW_0/1 | SW_02 | SW_RST | SW_01 | SW_00 | SW_PW | PAD / GND | D_RST | LED_00 | C_LED_01 | J_PW | U_OSC | LED_01 | C_LED_02 | J_MIDI | PAD / 03 | R_PAD_03 | LED_02 | C_LED_03 | PAD / 02 | C_ATM_0 | R_PAD_02 | R_I2C_0 | LED_03 | C_ATM_1 | C_LED_04 | PAD / 01 | H4_MainController_Rev_1 | Autofabricantes / Un instrumento para Henar / Spain, 2022 | Licensed CC BY-SA 3.0 | R_PAD_01 | LED_04 | C_LED_05 | C_LED_ARD_00 | PAD / 00 | R_I2C / ESP | R_I2C | L_RGB_ARD_00 | R_PAD_00 | SW_02 | SW_01 | SW_00 | LED_05 | R_ESP_I2C_1 | R_ESP_I2C_0 | R_I2C_1 | R_I2C_0 | R_SW_1 | R_SW_0 | C_LED_ARD_01 | VIN | SDA | SCL | GND | VIN | SDA | SCL | GND | JCON_00/01 | J_CON_02/03 | L_RGB_ARD_01
b_Silk: SW_02 | SW_RST | J_SW_02/03 | SW_01 | SW_00 | J_SW_00/01 | SW_PW | J_PWSW_0/1 | PAD / GND | INPUT POWER / 7-12V | H4_MainController_Rev_1 | Autofabricantes / Un instrumento para Henar / Spain, 2022 | 3V3 / GND / D15 / D2 / D4 / RX2 / TX2 / D5 / D18 / D19 / D21 / RX0 / TX0 / D22 / D23 | VIN / GND / D13 / D12 / D14 / D27 / D26 / D25 / D33 / D32 / D35 / D34 / VN / VP / EN | Licensed CC BY-SA 3.0 | PAD / 03 | PAD / 02 | PAD / 01 | TX0 / RX1 / GND / GND / D2 / D3 / D4 / D5 / D6 / D7 / D8 / D9 | PAD / 00 | C_VR_1 | RAW / GND / RST / VCC / A3 / A2 / A1 / A0 / 15 / 14 / 16 / 10 | JCON_00/01 | J_CON_02/03 | VIN | SDA | SCL | GND | VIN | SDA | SCL | GND
201bmp: Licensed / CC BY-SA 3.0 | C:/Users/PablodMM/Google Drive/Henar #3/03_Recursos/License_3_0_Logo.bmp